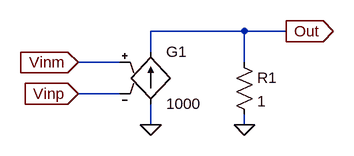
[diagram p0: schematic Ideal_op_amp.asc]
Ideal_op_amp.asc, the LTspice schematic file:
Version 4
SHEET 1 6300 692
WIRE 1616 240 1472 240
WIRE 1680 240 1616 240
WIRE 1472 272 1472 240
WIRE 1424 288 1360 288
WIRE 1616 288 1616 240
WIRE 1424 336 1360 336
WIRE 1472 384 1472 352
WIRE 1616 384 1616 368
FLAG 1472 384 0
FLAG 1680 240 Out
IOPIN 1680 240 Out
FLAG 1360 288 Vinm
IOPIN 1360 288 In
FLAG 1360 336 Vinp
IOPIN 1360 336 In
FLAG 1616 384 0
SYMBOL g 1472 256 R0
SYMATTR InstName G1
SYMATTR Value 1000
SYMBOL res 1600 272 R0
SYMATTR InstName R1
SYMATTR Value 1

The netlist it stands for:
* Ideal_op_amp.asc
G1 0 Out Vinm Vinp 1000
R1 Out 0 1
.backanno
.end